# EAGLE schematic c128power (EAGLE 6.5.0)
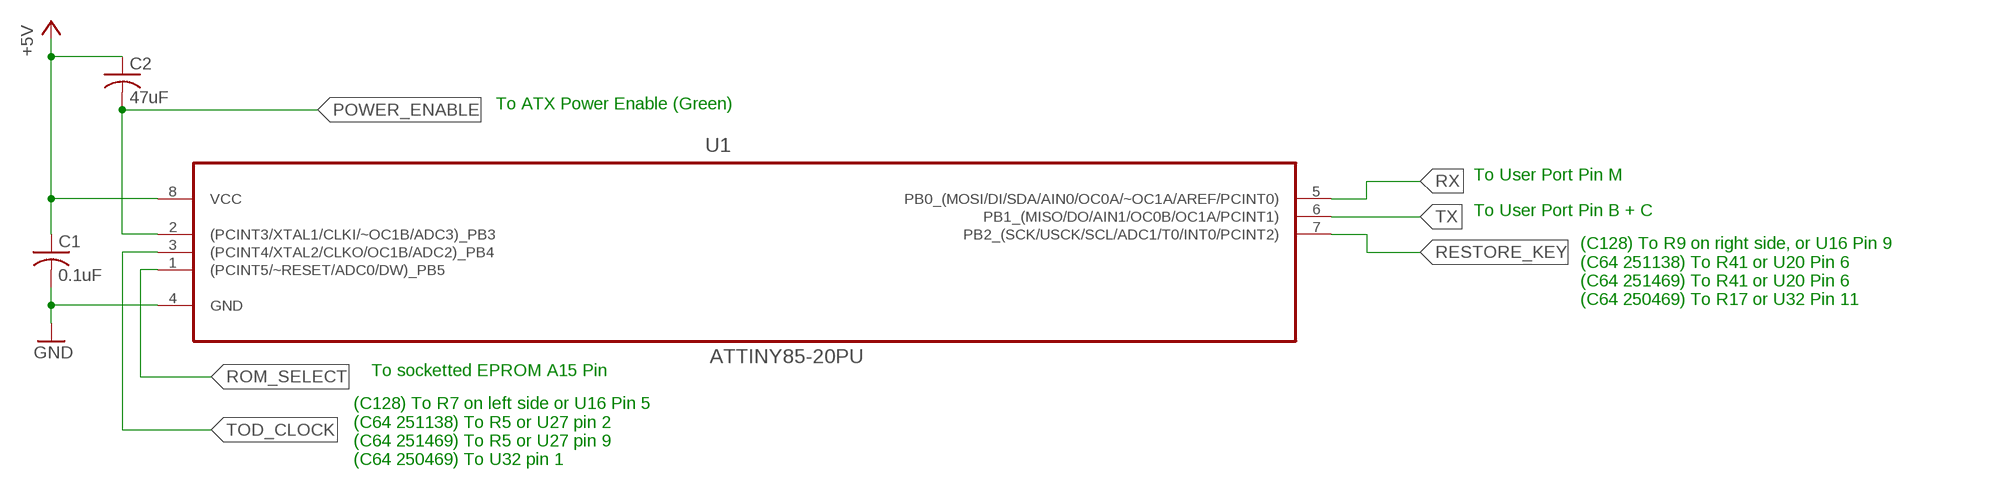
[diagram p0: schematic, sheet 1]

## Parts
C1  0.1uF  C-US050-024X044  [C050-024X044]
C2  47uF  C-US050-024X044  [C050-024X044]
U1  ATTINY85-20PU  [DIP254P762X533-8]

## Nets
+5V: C1.1 C2.1 U1.8(VCC)
GND: C1.2 U1.4(GND)
POWER_ENABLE: C2.2 U1.2((PCINT3/XTAL1/CLKI/~OC1B/ADC3)_PB3)
RESTORE_KEY: U1.7(PB2_(SCK/USCK/SCL/ADC1/T0/INT0/PCINT2))
ROM_SELECT: U1.1((PCINT5/~RESET/ADC0/DW)_PB5)
RX: U1.5(PB0_(MOSI/DI/SDA/AIN0/OC0A/~OC1A/AREF/PCINT0))
TOD_CLOCK: U1.3((PCINT4/XTAL2/CLKO/OC1B/ADC2)_PB4)
TX: U1.6(PB1_(MISO/DO/AIN1/OC0B/OC1A/PCINT1))

## Notes on the sheet
- To ATX Power Enable (Green)
- To User Port Pin M
- To User Port Pin B + C
- (C128) To R9 on right side, or U16 Pin 9
  (C64 251138) To R41 or U20 Pin 6
  (C64 251469) To R41 or U20 Pin 6
  (C64 250469) To R17 or U32 Pin 11
- To socketted EPROM A15 Pin
- (C128) To R7 on left side or U16 Pin 5
  (C64 251138) To R5 or U27 pin 2
  (C64 251469) To R5 or U27 pin 9
  (C64 250469) To U32 pin 1

## Library data of the parts
C1 C2 = rcl:C-US: CAPACITOR, American symbol
U1 = Atmel_By_element14_Batch_1-00:ATTINY85-20PU: 8-bit Microcontroller with In-System Programmable Flash; MPN: ATTINY85-20PU; OC_FARNELL: 1455162; OC_NEWARK: 58M3796; PACKAGE: PDIP-8; SUPPLIER: Atmel